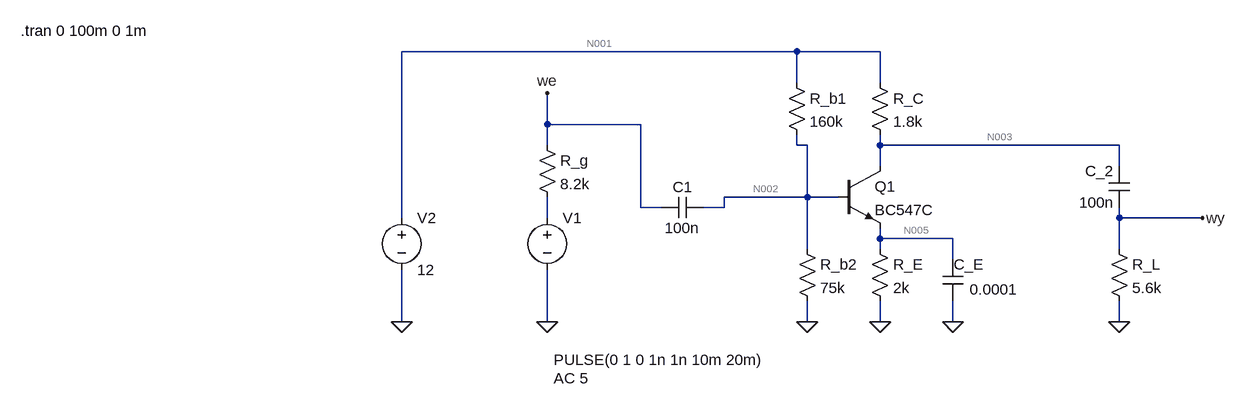
[diagram p0: schematic Draft3.asc]
Draft3.asc, the LTspice schematic file:
Version 4
SHEET 1 880 680
WIRE -288 -176 -896 -176
WIRE -160 -176 -288 -176
WIRE -288 -128 -288 -176
WIRE -160 -128 -160 -176
WIRE -672 -64 -672 -112
WIRE -528 -64 -672 -64
WIRE -672 -32 -672 -64
WIRE -288 -32 -288 -48
WIRE -272 -32 -288 -32
WIRE -160 -32 -160 -48
WIRE 208 -32 -160 -32
WIRE -160 0 -160 -32
WIRE 208 0 208 -32
WIRE -272 48 -272 -32
WIRE -272 48 -400 48
WIRE -224 48 -272 48
WIRE -528 64 -528 -64
WIRE -496 64 -528 64
WIRE -400 64 -400 48
WIRE -400 64 -432 64
WIRE -896 80 -896 -176
WIRE -672 80 -672 48
WIRE 208 80 208 64
WIRE 336 80 208 80
WIRE -160 112 -160 96
WIRE -48 112 -160 112
WIRE -272 128 -272 48
WIRE -160 128 -160 112
WIRE 208 128 208 80
WIRE -48 144 -48 112
WIRE -896 240 -896 160
WIRE -672 240 -672 160
WIRE -272 240 -272 208
WIRE -160 240 -160 208
WIRE -48 240 -48 208
WIRE 208 240 208 208
FLAG -896 240 0
FLAG -672 240 0
FLAG -272 240 0
FLAG -160 240 0
FLAG 208 240 0
FLAG -48 240 0
FLAG -672 -112 we
FLAG 336 80 wy
SYMBOL voltage -672 64 R0
WINDOW 3 10 235 Left 2
WINDOW 123 10 263 Left 2
WINDOW 39 0 0 Left 0
SYMATTR InstName V1
SYMATTR Value PULSE(0 1 0 1n 1n 10m 20m)
SYMATTR Value2 AC 5
SYMBOL voltage -896 64 R0
WINDOW 123 0 0 Left 0
WINDOW 39 0 0 Left 0
SYMATTR InstName V2
SYMATTR Value 12
SYMBOL res -688 -48 R0
SYMATTR InstName R_g
SYMATTR Value 8.2k
SYMBOL res -288 112 R0
SYMATTR InstName R_b2
SYMATTR Value 75k
SYMBOL res -304 -144 R0
SYMATTR InstName R_b1
SYMATTR Value 160k
SYMBOL res -176 112 R0
SYMATTR InstName R_E
SYMATTR Value 2k
SYMBOL res 192 112 R0
SYMATTR InstName R_L
SYMATTR Value 5.6k
SYMBOL cap -432 48 R90
WINDOW 0 0 32 VBottom 2
WINDOW 3 32 32 VTop 2
SYMATTR InstName C1
SYMATTR Value 100n
SYMBOL cap -32 208 R180
WINDOW 0 -32 56 Left 2
WINDOW 3 -84 18 Left 2
SYMATTR InstName C_E
SYMATTR Value 0.0001
SYMBOL cap 224 64 R180
WINDOW 0 24 56 Left 2
WINDOW 3 24 8 Left 2
SYMATTR InstName C_2
SYMATTR Value 100n
SYMBOL npn -224 0 R0
SYMATTR InstName Q1
SYMATTR Value BC547C
SYMBOL res -176 -144 R0
SYMATTR InstName R_C
SYMATTR Value 1.8k
TEXT -1482 -208 Left 2 !.tran 0 100m 0 1m

The netlist it stands for:
* Draft3.asc
V1 N004 0 PULSE(0 1 0 1n 1n 10m 20m) AC 5
V2 N001 0 12
R_g we N004 8.2k
R_b2 N002 0 75k
R_b1 N001 N002 160k
R_E N005 0 2k
R_L wy 0 5.6k
C1 N002 we 100n
C_E 0 N005 0.0001
C_2 wy N003 100n
Q1 N003 N002 N005 0 BC547C
R_C N001 N003 1.8k
.model NPN NPN
.model PNP PNP
.lib standard.bjt
.tran 0 100m 0 1m
.backanno
.end

* Results of the author's LTspice run, read from the files saved beside the schematic
* Operating Point, zero values left out:
*   V(n001) = 12 V
*   V(n002) = 3.675 V
*   V(n005) = 3.044 V
*   V(n003) = 9.266 V
*   Ic(Q1) = 1.519 mA
*   Ib(Q1) = 3.041 µA
*   Ie(Q1) = -1.522 mA
*   I(R_c) = 1.519 mA
*   I(R_e) = 1.522 mA
*   I(R_b1) = 52.03 µA
*   I(R_b2) = 48.99 µA
*   I(V2) = -1.571 mA
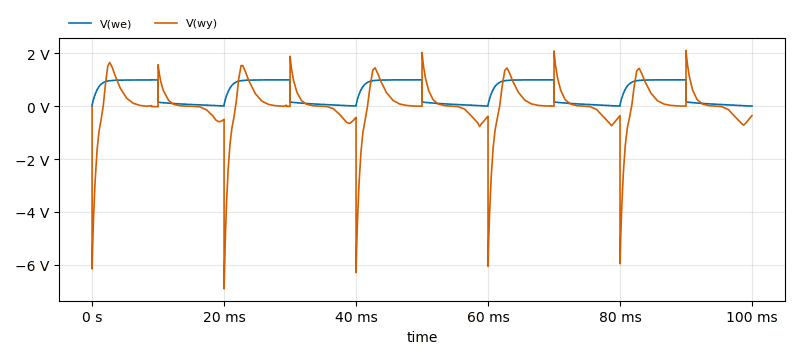
[diagram p1: Transient Analysis of Draft3.asc, plotted from the saved traces]
* Transient Analysis, 1 run:
*   V(we): min 0 V, max 1 V, average 498 mV, rms 667.6 mV, last 9.21 mV
*   V(wy): min -6.913 V, max 2.116 V, average 1.106 mV, rms 941.6 mV, last -351.6 mV